# EasyEDA Pro project 包裹款-触摸屏控制板-V1.3(1).epro, schematic Schematic2
Assembly Variant: Basic; Board Name: Board2; Create Date: 2026-06-04; Page Name: P1; Project Name: 包裹款-触摸屏控制板-V1.3; Schematic Name: Schematic2; Update Date: 2026-06-04; Company: 嘉立创EDA; Page Size: A4; Version: V1.0
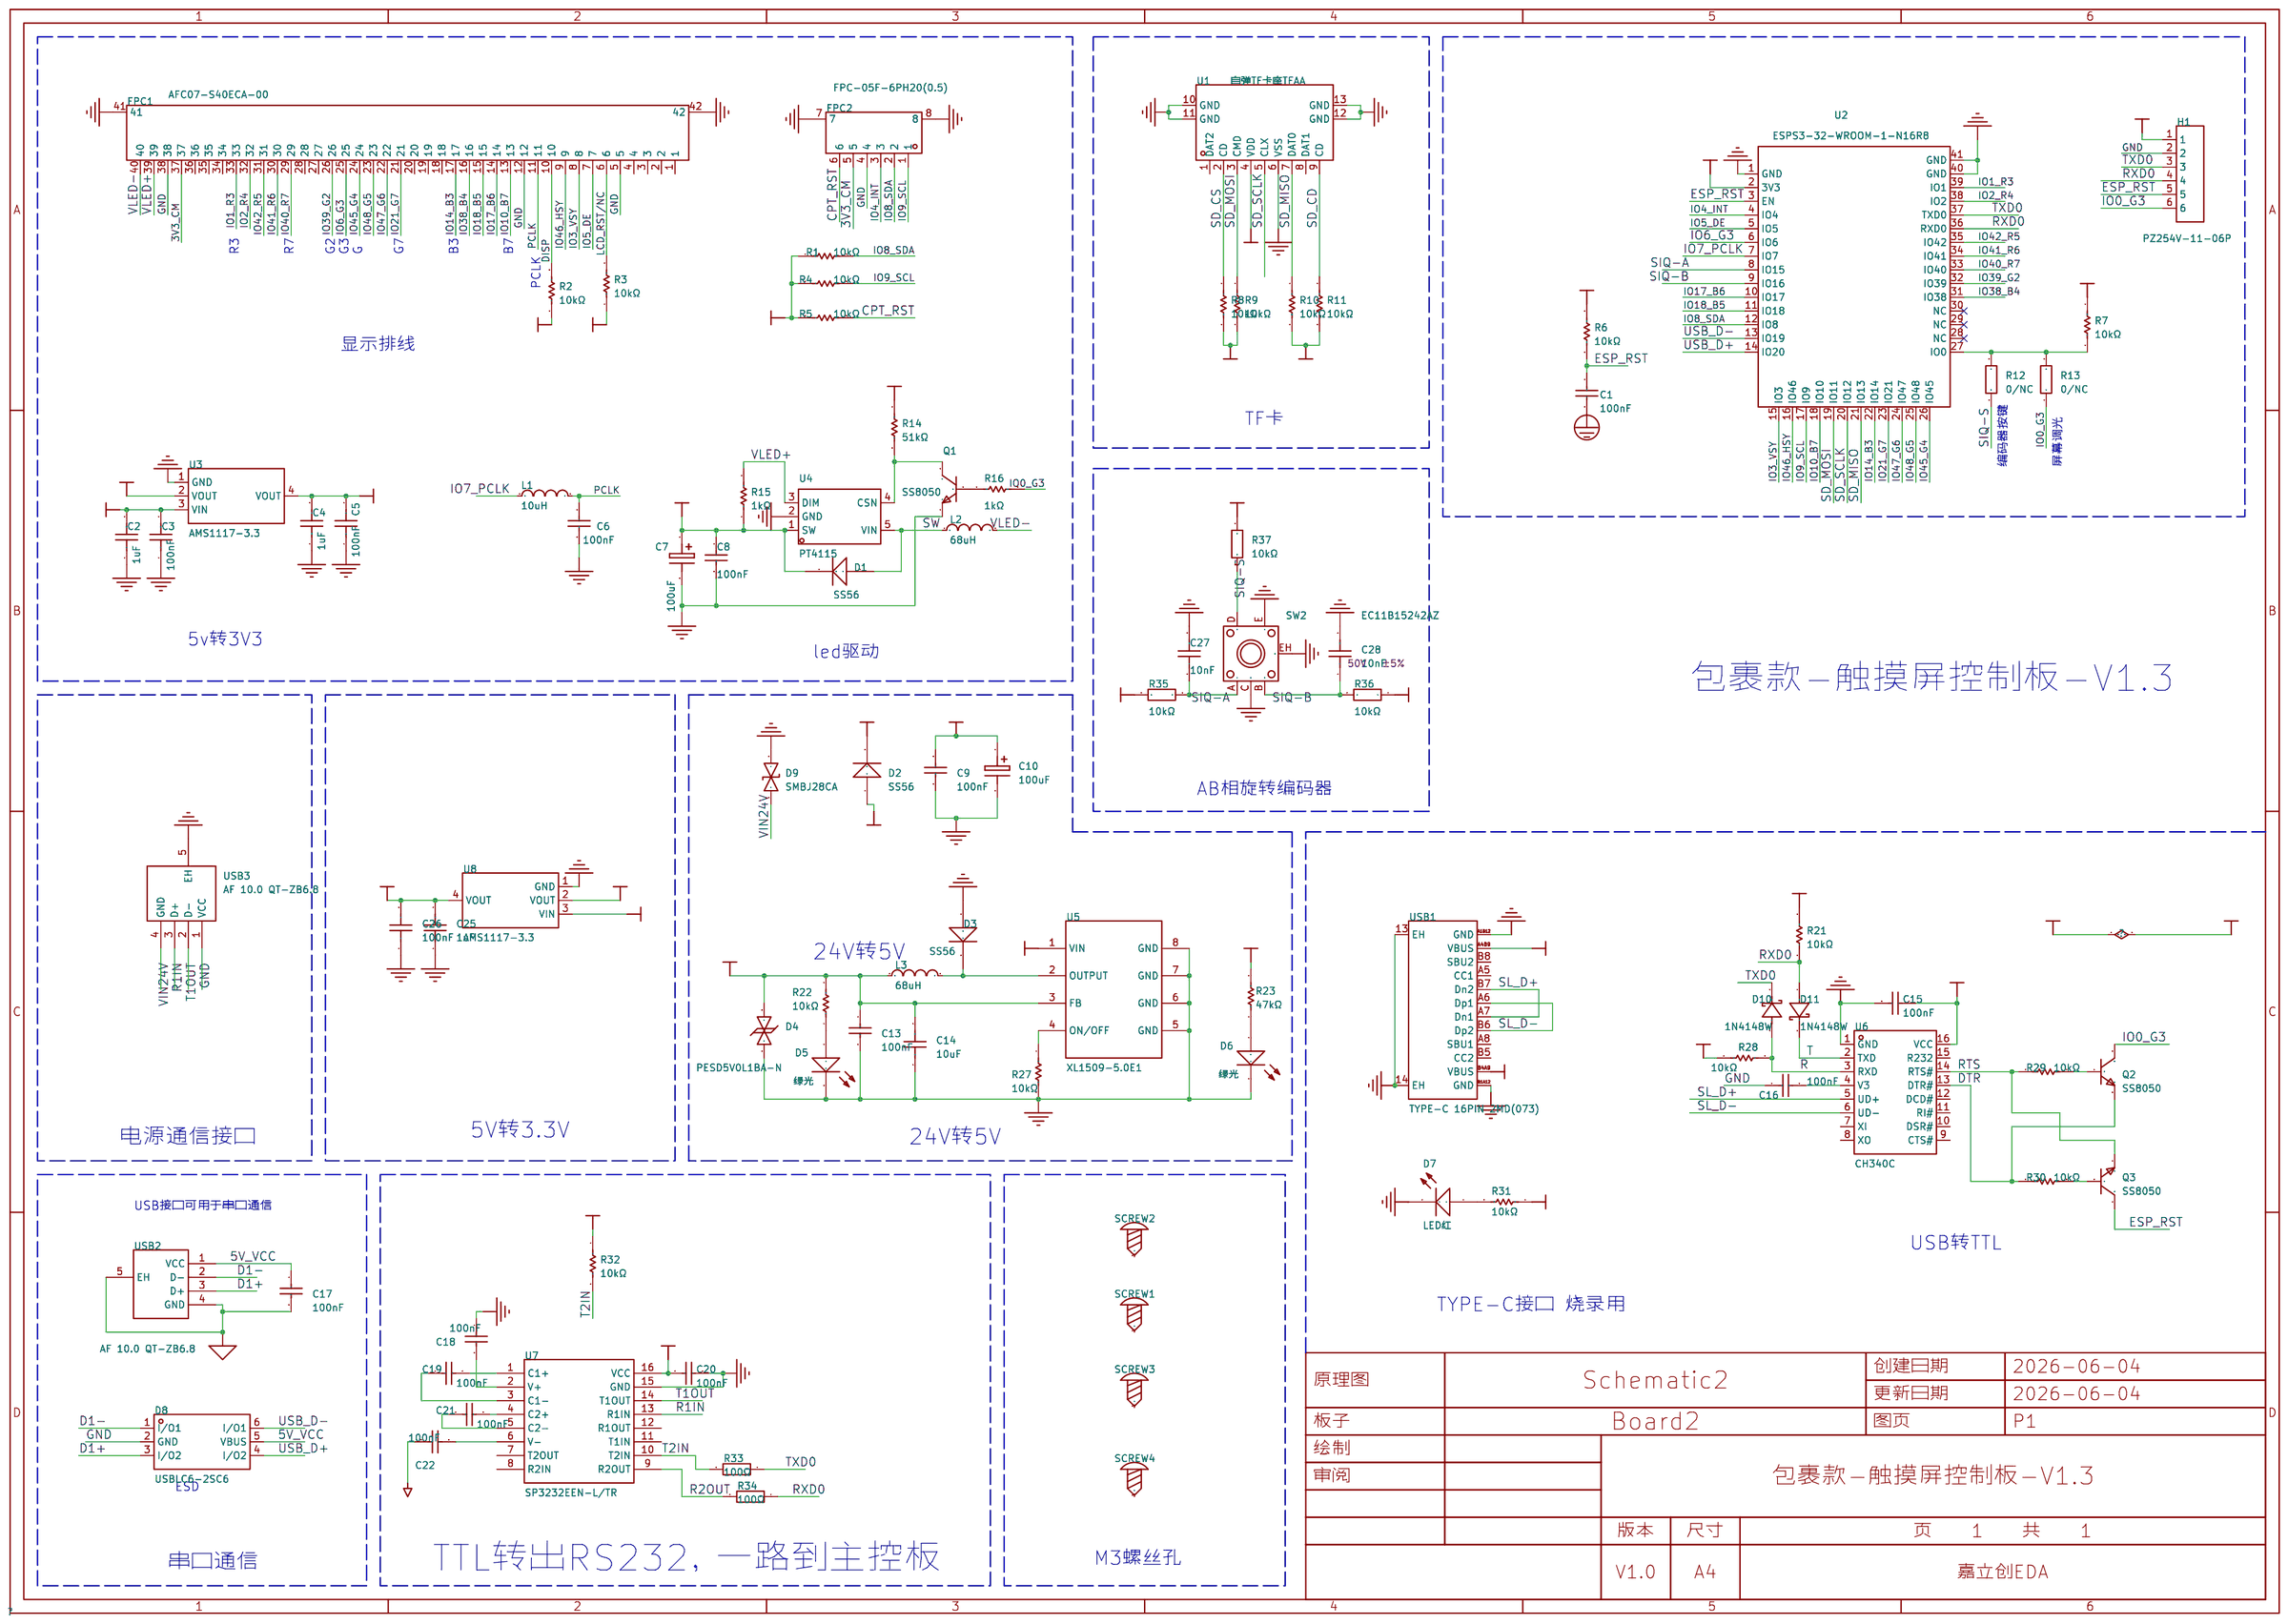
[diagram p0: schematic sheet]

## Parts
C1  100nF  [C0603]
C2  1uF  [C0603]
C3  100nF  [C0603]
C4  1uF  [C0603]
C5  100nF  [C0603]
C6  100nF  [C0603]
C7  100uF  [电解电容贴片6X6]
C8  100nF  [C0603]
C9  100nF  [C0603]
C10  100uF  [电解电容贴片6X6]
C13  100nF  [C0603]
C14  10uF  [C0603]
C15  100nF  [C0603]
C16  100nF  [C0603]
C17  100nF  [C0603]
C18  100nF  [C0603]
C19  100nF  [C0603]
C20  100nF  [C0603]
C21  100nF  [C0603]
C22  100nF  [C0603]
C25  1uF  [C0603]
C26  100nF  [C0603]
C27  10nF  [C0603]
C28  10nF  [C0603]
D1  SS56  [SMA]
D2  SS56  [SMA]
D3  SS56  [SMA]
D4  PESD5V0L1BA-N  [SOD-323_L1.8-W1.3-LS2.5-BI]
D5  绿光  [0603LED]
D6  绿光  [0603LED]
D7  LED红  [0603L]
D8  USBLC6-2SC6  [SOT-23-6_L2.9-W1.6-P0.95-LS2.8-BL]
D9  SMBJ28CA  [SMB_L4.3-W3.6-LS5.4-BI]
D10  1N4148W  [SOD-123_L2.7-W1.6-LS3.7-FD]
D11  1N4148W  [SOD-123_L2.7-W1.6-LS3.7-FD]
FPC1  AFC07-S40ECA-00  [FPC-SMD_P0.50-40P_LCS-SJ-H2.0]
FPC2  FPC-05F-6PH20(0.5)  [FPC-SMD_6P-P0.50_XUNPU_FPC-05F-6PH20]
H1  PZ254V-11-06P  [HDR-TH_6P-P2.54-V-M]
L1  10uH  [L0603]
L2  68uH  [IND-SMD_L7.0-W7.0_SMDRI74-330MT]
L3  68uH  [IND-SMD_L7.0-W7.0_SMDRI74-330MT]
Q1  SS8050  [SOT-23-3_L2.9-W1.3-P1.90-LS2.4-BR]
Q2  SS8050  [SOT-23-3_L2.9-W1.3-P1.90-LS2.4-BR]
Q3  SS8050  [SOT-23-3_L2.9-W1.3-P1.90-LS2.4-BR]
R1  10kΩ  [R0603]
R2  10kΩ  [R0603]
R3  10kΩ  [R0603]
R4  10kΩ  [R0603]
R5  10kΩ  [R0603]
R6  10kΩ  [R0603]
R7  10kΩ  [R0603]
R8  10kΩ  [R0603]
R9  10kΩ  [R0603]
R10  10kΩ  [R0603]
R11  10kΩ  [R0603]
R12  0/NC  [R0603]
R13  0/NC  [R0603]
R14  51kΩ  [R0603]
R15  1kΩ  [R0603]
R16  1kΩ  [R0603]
R21  10kΩ  [R0603]
R22  10kΩ  [R0603]
R23  47kΩ  [R0603]
R27  10kΩ  [R0603]
R28  10kΩ  [R0603]
R29  10kΩ  [R0603]
R30  10kΩ  [R0603]
R31  10kΩ  [R0603]
R32  10kΩ  [R0603]
R33  100Ω  [R0603]
R34  100Ω  [R0603]
R35  10kΩ  [R0603]
R36  10kΩ  [R0603]
R37  10kΩ  [R0603]
SCREW1  -  [M3螺丝]
SCREW2  -  [M3螺丝]
SCREW3  -  [M3螺丝]
SCREW4  -  [M3螺丝]
SW2  EC11B15242AZ  [SW-TH_EC11B1524XX]
U1  自弹TF卡座TFAA  [SIM-SMD_C9900015645]
U2  ESPS3-32-WROOM-1-N16R8  [WIRELM-SMD_ESP32-S3-WROOM-2-N32R8V]
U3  AMS1117-3.3  [SOT-223-3_L6.5-W3.4-P2.30-LS7.0-BR]
U4  PT4115  [SOT-89-5_L4.5-W2.5-P1.50-LS4.5-BR]
U5  XL1509-5.0E1  [SOIC-8_L5.0-W4.0-P1.27-LS6.0-BL]
U6  CH340C  [SOIC-16_L9.9-W3.9-P1.27-LS6.0-BL]
U7  SP3232EEN-L/TR  [SOIC-16_L9.9-W3.9-P1.27-LS6.0-BL]
U8  AMS1117-3.3  [SOT-223-3_L6.5-W3.4-P2.30-LS7.0-BR]
USB1  TYPE-C 16PIN 2MD(073)  [USB-C-SMD_TYPE-C-16PIN-2MD-073]
USB2  AF 10.0 QT-ZB6.8  [USB-A-SMD_AF-10.0-QT-ZB6.8]
USB3  AF 10.0 QT-ZB6.8  [USB-A-SMD_AF-10.0-QT-ZB6.8]

## Library data of the parts
C1 C3 C5 C6 C8 C9 C13 C15-C22 C26 = CL10B104KB8NNNC: 容值:100nF;精度:±10%;额定电压:50V;温度系数:X7R;; LCSC Part Name: 100nF ±10% 50V; Supplier Part: C1591; Manufacturer: SAMSUNG(三星); Supplier Footprint: 0603; JLCPCB Part Class: Extended Part; Datasheet: https://item.szlcsc.com/datasheet/CL10B104KB8NNNC/1943.html; Supplier: LCSC; Tolerance: ±10%; Voltage Rating: 50V; Temperature Coefficient: X7R
C2 C4 C25 = CGA0603X5R105K500JT: 容值:1uF;精度:±10%;额定电压:50V;温度系数:X5R;; LCSC Part Name: 1uF ±10% 50V; Supplier Part: C6119852; Manufacturer: HRE(芯声); Supplier Footprint: 0603; JLCPCB Part Class: Extended Part; Datasheet: https://item.szlcsc.com/datasheet/CGA0603X5R105K500JT/7062558.html; Supplier: LCSC; Tolerance: ±10%; Voltage Rating: 50V; Temperature Coefficient: X5R
C7 C10 = RT35V100M6X5: 容值:100uF;精度:±20%;额定电压:35V;纹波电流:60mA@120Hz;; LCSC Part Name: 100uF ±20% 35V; Supplier Part: C48971024; Manufacturer: JIERR(捷而瑞); Supplier Footprint: SMD,D6.3xL5.4mm; JLCPCB Part Class: Extended Part; Datasheet: https://item.szlcsc.com/datasheet/RT35V100M6X5/51296229.html; Supplier: LCSC; Tolerance: ±20%; Voltage Rating: 35V; Ripple Current: 60mA@120Hz; Diameter: 6.3mm; Height - Seated (Max): 5.4mm; Lifetime: 2000hrs@105℃; Operating Temperature: -40℃~+105℃
C14 = CL10A106MA8NRNC: 容值:10uF;精度:±20%;额定电压:25V;温度系数:X5R;; LCSC Part Name: 10uF ±20% 25V; Supplier Part: C96446; Manufacturer: SAMSUNG(三星); Supplier Footprint: 0603; JLCPCB Part Class: Basic Part; Datasheet: https://item.szlcsc.com/datasheet/CL10A106MA8NRNC/97651.html; Supplier: LCSC; Tolerance: ±20%; Voltage Rating: 25V; Temperature Coefficient: X5R
C27 C28 = GRM1885C1H103JA01D: 容值:10nF;精度:±5%;额定电压:50V;材质(温度系数):C0G;; LCSC Part Name: 10nF ±5% 50V; Supplier Part: C85973; Manufacturer: muRata(村田); Supplier Footprint: 0603; JLCPCB Part Class: Extended Part; Datasheet: https://atta.szlcsc.com/upload/public/pdf/source/20200305/C490387_23319AE8C154DEB24C505E6C82A8106A.pdf; Supplier: LCSC; Tolerance: ±5%; Voltage Rated: 50V; Temperature Coefficient: C0G
D1 D3 = SS56: Design Item ID: 1N4148; Library Name: SCH--װ--
D2 = SS56: Design Item ID: 1N4148; Library Name: SCH封装库
D4 = PESD5V0S1BBN: 极性:Bidirectional;反向关断电压（典型值）:5V (Max);击穿电压（最小值）:6V;箝位电压:15V;峰值脉冲电流（10/1000us）:5A (8/20us);; Supplier Part: C314264; Manufacturer: BORN伯恩半导体; Supplier Footprint: SOD-523; JLCPCB Part Class: Extended Part; Datasheet: https://atta.szlcsc.com/upload/public/pdf/source/20181015/C314264_F9AC5761AC2631DA841FBD1D9C6821E3.pdf; Supplier: LCSC; Polarity: Bidirectional; Voltage - Reverse Standoff (Typ): 5V (Max); Voltage - Breakdown (Min): 6V; Voltage - Clamping (Max) @ Ipp: 15V; Current - Peak Pulse (10/1000μs): 5A (8/20us)
D5 D6 = 绿光: Origin Footprint 2: LED(小); Design Item ID: LED; Library Name: SCH封装库
D7 = LED3: Typical BLUE SiC LED; Published: 8-Jun-2000; LatestRevisionDate: 17-Dec-2003; LatestRevisionNote: PCB Footprint replaced.; DatasheetVersion: 16-Apr-2002; PackageVersion: 16-Apr-2002; PackageReference: 3.5X2.8X1.9; Publisher: Altium Limited; PackageDescription: SM LED; 2 C-Bend Leads; Body 3.5 x 2.8 x 1.9 mm, inc leads (LxWxH typ); Origin Footprint 2: 3.5X2.8X1.9; Library Name: Miscellaneous Devices; Check: true
D8 = USBLC6-2SC6: 最大钳位电压:15V;击穿电压:6V;; Supplier Part: C2687116; Manufacturer: UMW(友台半导体); Supplier Footprint: SOT-23-6; JLCPCB Part Class: 扩展库; Datasheet: https://atta.szlcsc.com/upload/public/pdf/source/20231109/512642D850D9873E7C519F71E85B9A10.pdf; Supplier: LCSC; Maximum Clamping Voltage: 15V; Breakdown Voltage: 6V; Number of Lines: 双路; Type: ESD
D9 = SMBJ28CA_C151259: 反向截止电压(Vrwm):28V;最大钳位电压:45.4V;峰值脉冲电流(Ipp)@10/1000us:13.3A;峰值脉冲功率(Ppp)@10/1000us:600W;击穿电压:31.1V;; Supplier Part: C151259; Manufacturer: Littelfuse(美国力特); Supplier Footprint: SMB(DO-214AA); JLCPCB Part Class: Extended Part; Datasheet: https://atta.szlcsc.com/upload/public/pdf/source/20190807/C409416_D98C874D944FBE9BE31A2BD6B7A21533.pdf; Supplier: LCSC; Reverse Stand-Off Voltage (Vrwm): 28V; Maximum Clamping Voltage: 45.4V; Peak Pulse Current (Ipp)@10/1000us: 13.3A; Peak Pulse Power Dissipation (Ppp)@10/1000us: 600W; Breakdown Voltage: 31.1V; Type: TVS
D10 D11 = 1N4148W_C7420318: 二极管配置:独立式;整流电流:150mA;直流反向耐压(Vr):100V;正向压降(Vf):1.25V@150mA;反向恢复时间(Trr):4ns;; LCSC Part Name: 100V 150mA; Supplier Part: C7420318; Manufacturer: R+O(宏嘉诚); Supplier Footprint: SOD-123; JLCPCB Part Class: Extended Part; Datasheet: https://item.szlcsc.com/datasheet/1N4148W/8397140.html; Supplier: LCSC; Diode Configuration: 独立式; Pd - Power Dissipation: 400mW; Current - Rectified: 150mA; Voltage - DC Reverse(Vr): 100V; Voltage - Forward(Vf@If): 1.25V@150mA; Non-Repetitive Peak Forward Surge Current: 2A; Reverse Leakage Current (Ir): 1uA@75V; Reverse Recovery Time (trr): 4ns; Operating Junction Temperature Range: -55℃~+150℃
FPC1 = AFC07-S40ECA-00: 锁定特性:抽屉式;触点类型:上接;触点数量:40P;间距:0.5mm;安装方式:卧贴;; LCSC Part Name: 间距:0.5mm P数:40P 抽屉式 上接; Supplier Part: C262648; Manufacturer: JS(钜硕电子); Supplier Footprint: SMD,P=0.5mm,卧贴; JLCPCB Part Class: 扩展库; Datasheet: https://item.szlcsc.com/datasheet/AFC07-S40ECA-00/253907.html; Supplier: LCSC; Locking Feature: 抽屉式; Contact Type: 上接; Number of Contacts: 40P; Pitch: 0.5mm; Mounting Type: 卧贴; FFC, FCB Thickness: 0.3mm; Height Above Board: 2mm
FPC2 = FPC-05F-6PH20: 锁定特性:翻盖式;触点类型:卧贴;触点数量:6P;间距:0.5mm;安装方式:下接;工作温度:-25℃~+85℃;; LCSC Part Name: 翻盖式 卧贴 P数:6P 间距:0.5mm; Supplier Part: C2856796; Manufacturer: XUNPU(讯普); Supplier Footprint: SMD,P=0.5mm,卧贴; JLCPCB Part Class: 扩展库; Datasheet: https://item.szlcsc.com/datasheet/FPC-05F-6PH20/3056894.html; Supplier: LCSC; Locking Feature: 翻盖式; Contact Type: 卧贴; Number of Contacts: 6P; Pitch: 0.5mm; Mounting Type: 下接; FFC, FCB Thickness: 0.3mm; Height Above Board: 2mm; Contact Material: 磷青铜; Contact Plating: 锡; Operating Temperature: -25℃~+85℃; Rated Voltage (Max): 50V; Current Rating (Max): 500mA
H1 = PZ254V-11-06P: 插针结构:1x6P;间距:2.54mm;行距:-;圆针/方针:方针;安装方式:直插;排数:单排;总PIN位数:6P;额定电流:-;额定电压:-;配合针长度:6mm;塑高:2.5mm;端接针长度:3mm;触头材质:黄铜;触头镀层:-;工作温度:-40℃~+105℃;颜色:黑色;; LCSC Part Name: 1x6P 间距:2.54mm 方针 直插; Supplier Part: C492405; Manufacturer: XFCN(兴飞); Supplier Footprint: 插件,P=2.54mm; JLCPCB Part Class: 扩展库; Datasheet: https://item.szlcsc.com/datasheet/PZ254V-11-06P/502961.html; Supplier: LCSC; Pin Structure: 1x6P; Pitch: 2.54mm; Circluar Pins/Square Pins: 方针; Mounting Type: 直插; Number of Rows: 单排; Number of Pins: 6P; Length of Mating Pin: 6mm; Insulation Height: 2.5mm; Length of End Connection Pin: 3mm; Contact Material: 黄铜; Operating Temperature: -40℃~+105℃; Color: 黑色
L1 = SDFL1608S100KTF: 电感值:10uH;精度:±10%;额定电流:3mA;饱和电流(Isat):-;直流电阻(DCR):1.85Ω;; LCSC Part Name: 10uH ±10%; Supplier Part: C1035; Manufacturer: Sunlord(顺络); Supplier Footprint: 0603; JLCPCB Part Class: 基础库; Datasheet: https://item.szlcsc.com/datasheet/SDFL1608S100KTF/1387.html; Supplier: LCSC; Tolerance: ±10%; Current Rating: 3mA; DC Resistance(DCR): 1.85Ω; Q @ Frequency: 30@2MHz; Frequency - Self Resonant: 17MHz
L2 L3 = SMMS0650-680M: 电感值:68uH;精度:±20%;额定电流:1.5A;饱和电流(Isat):2A;类型:-;; LCSC Part Name: 68uH ±20% 2A; Supplier Part: C2894721; Manufacturer: SXN(顺翔诺); Supplier Footprint: SMD,6.6x7.1mm; JLCPCB Part Class: Extended Part; Datasheet: https://item.szlcsc.com/datasheet/SMMS0650-680M/3130468.html; Supplier: LCSC; Tolerance: ±20%; Current Rating: 1.5A; Current - Saturation(Isat): 2A; DC Resistance(DCR): 442mΩ
Q1-Q3 = SS8050: LCSC Part Name: NPN 25V 1.5A 120-400 SOT-23; Supplier Part: C2931717; Manufacturer: Doeshare(德芯); Supplier Footprint: SOT-23; JLCPCB Part Class: 扩展库; Datasheet: https://atta.szlcsc.com/upload/public/pdf/source/20220106/99F9A3DFCBDD91265C711555CE6390BF.pdf; Supplier: LCSC
R1-R7 R21 R22 R27 R28 R35-R37 = FRC0603J103 TS: 电阻类型:厚膜电阻;阻值:10kΩ;精度:±5%;功率:100mW;工作电压:75V;温度系数:±100ppm/℃;; LCSC Part Name: 10kΩ ±5% 100mW 厚膜电阻; Supplier Part: C2930027; Manufacturer: FOJAN(富捷); Supplier Footprint: 0603; JLCPCB Part Class: Extended Part; Datasheet: https://item.szlcsc.com/datasheet/FRC0603J103%2520TS/3266960.html; Supplier: LCSC; Type: 厚膜电阻; Tolerance: ±5%; Power(Watts): 100mW; Voltage-Supply(Max): 75V; Temperature Coefficient: ±100ppm/℃; Operating Temperature: -55℃~+155℃
R8-R11 R29-R32 = RT0603BRD0710KL: 电阻类型:薄膜电阻;阻值:10kΩ;精度:±0.1%;功率:100mW;工作电压:75V;温度系数:±25ppm/℃;; LCSC Part Name: 薄膜电阻 10kΩ ±0.1% 100mW; Supplier Part: C95204; Manufacturer: YAGEO(国巨); Supplier Footprint: 0603; JLCPCB Part Class: Extended Part; Datasheet: https://item.szlcsc.com/datasheet/RT0603BRD0710KL/96405.html; Supplier: LCSC; Type: 薄膜电阻; Tolerance: ±0.1%; Power(Watts): 100mW; Voltage-Supply(Max): 75V; Temperature Coefficient: ±25ppm/℃; Operating Temperature: -55℃~+155℃
R12 R13 = Res_0603: Supplier Footprint: 0603
R14 = 0603WAF5102T5E: 电阻类型:厚膜电阻;阻值:51kΩ;精度:±1%;功率:100mW;工作电压:75V;温度系数:±100ppm/℃;; LCSC Part Name: 51kΩ ±1% 100mW 厚膜电阻; Supplier Part: C23196; Manufacturer: UNI-ROYAL(厚声); Supplier Footprint: 0603; JLCPCB Part Class: Basic Part; Datasheet: https://item.szlcsc.com/datasheet/0603WAF5102T5E/23923.html; Supplier: LCSC; Type: 厚膜电阻; Tolerance: ±1%; Power(Watts): 100mW; Voltage-Supply(Max): 75V; Temperature Coefficient: ±100ppm/℃; Operating Temperature: -55℃~+155℃
R15 R16 = FRC0603F1001TS: 电阻类型:厚膜电阻;阻值:1kΩ;精度:±1%;功率:100mW;工作电压:75V;温度系数:±100ppm/℃;; LCSC Part Name: 1kΩ ±1% 100mW 厚膜电阻; Supplier Part: C2907002; Manufacturer: FOJAN(富捷); Supplier Footprint: 0603; JLCPCB Part Class: Extended Part; Supplier: LCSC; Type: 厚膜电阻; Tolerance: ±1%; Power(Watts): 100mW; Voltage-Supply(Max): 75V; Temperature Coefficient: ±100ppm/℃; Operating Temperature: -55℃~+155℃
R23 = FRC0603F4702TS: 电阻类型:厚膜电阻;阻值:47kΩ;精度:±1%;功率:100mW;工作电压:75V;温度系数:±100ppm/℃;; LCSC Part Name: 47kΩ ±1% 100mW 厚膜电阻; Supplier Part: C2907042; Manufacturer: FOJAN(富捷); Supplier Footprint: 0603; JLCPCB Part Class: Extended Part; Supplier: LCSC; Type: 厚膜电阻; Tolerance: ±1%; Power(Watts): 100mW; Voltage-Supply(Max): 75V; Temperature Coefficient: ±100ppm/℃; Operating Temperature: -55℃~+155℃
R33 R34 = 0603WAF1000T5E: 电阻类型:厚膜电阻;阻值:100Ω;精度:±1%;功率:100mW;最大工作电压:75V;温度系数:±200ppm/℃;; LCSC Part Name: 100Ω ±1% 100mW 厚膜电阻; Supplier Part: C22775; Manufacturer: UNI-ROYAL(厚声); Supplier Footprint: 0603; JLCPCB Part Class: Basic Part; Datasheet: https://atta.szlcsc.com/upload/public/pdf/source/20200306/C422600_1E6D84923E4A46A82E41ADD87F860B5C.pdf; Supplier: LCSC; Type: 厚膜电阻; Tolerance: ±1%; Power(Watts): 100mW; Overload Voltage (Max): 75V; Temperature Coefficient: ±200ppm/℃; Operating Temperature Range: -55℃~+155℃
SCREW1-SCREW4 = M3螺丝: Supplier Footprint: 插件
SW2 = EC11B15242AZ: LCSC Part Name: EC11B15242AZ 三件套 停产; Supplier Part: C470746; Manufacturer: ALPSALPINE(阿尔卑斯阿尔派); Supplier Footprint: 插件; JLCPCB Part Class: Extended Part; Datasheet: https://item.szlcsc.com/datasheet/EC11B15242AZ/476826.html; Supplier: LCSC
U1 = 自弹TF卡座TFAA: Supplier Part: C9900015645; Supplier Footprint: SMD; JLCPCB Part Class: 扩展库; Supplier: LCSC
U2 = ESP32-S3-WROOM-2-N32R8V: 核心处理器:ESP32-S3R8V芯片;频率:2.4GHz;发射功率:20.5dBm;; Supplier Part: C3021270; Manufacturer: ESPRESSIF(乐鑫); Supplier Footprint: SMD-41P; JLCPCB Part Class: 扩展库; Datasheet: https://atta.szlcsc.com/upload/public/pdf/source/20240130/C1D348304CAAF72A05B43D2BF874139A.pdf; Supplier: LCSC; Core Processor: ESP32-S3R8V芯片; Support Interface: I2C；GPIO；SPI；PWM；ADC；UART；USB；I2S; Output Power: 20.5dBm
U3 U8 = AMS1117-3.3_C6186: 输出类型:固定;工作电压:15V;输出电压:3.3V;输出电流:1A;电源纹波抑制比(PSRR):72dB@(120Hz);输出极性:正极;; LCSC Part Name: 3.3V 1A 15V; Supplier Part: C6186; Manufacturer: AMS; Supplier Footprint: SOT-223; JLCPCB Part Class: Basic Part; Datasheet: https://item.szlcsc.com/datasheet/AMS1117-3.3/6652.html; Supplier: LCSC; Output Type: 固定; Voltage - Supply: 15V; Output Voltage: 3.3V; Output Current: 1A; Power Supply Rejection Ratio (PSRR): 72dB@(120Hz); Voltage Dropout: 1.1V@(800mA); standby current: 5mA; Noise: 0.003%Vout; Features: 过流保护；热关断; Operating Temperature: -40℃~+125℃; Output Configuration: 正极; Number of Outputs: 1
U4 = PT4115_C347356: 类型:DC-DC;工作电压(DC):6V~30V;开关频率:1MHz;通道数:-;输出电压:-;输出电流:1.2A;调光:PWM；模拟;拓扑结构:降压;; LCSC Part Name: 30 V/1.2 A高调光比LED恒流驱动器; Supplier Part: C347356; Manufacturer: UMW(友台半导体); Supplier Footprint: SOT-89-5; JLCPCB Part Class: 扩展库; Datasheet: https://item.szlcsc.com/datasheet/PT4115/324016.html; Supplier: LCSC; Type: DC-DC; Voltage - Input(DC): 6V~30V; Frequency - Switching: 1MHz; Output Current: 1.2A; Dimming: PWM；模拟; Features: 过温保护(OTP); Topology: 降压; Operating temperature: -25℃~+85℃; Switch Tube (Built-In/External): 内置; Constant Current Accuracy: 5%
U5 = XL1509-5.0E1: 功能类型:降压型;工作电压:4.5V~40V;输出电压:5V;输出电流:2A;输出类型:固定;; LCSC Part Name: 2A 150KHz 40V 降压 DC-DC 转换器; Supplier Part: C61063; Manufacturer: XLSEMI(芯龙); Supplier Footprint: SOIC-8; JLCPCB Part Class: Basic Part; Datasheet: https://item.szlcsc.com/datasheet/XL1509-5.0E1/62115.html; Supplier: LCSC; Function: 降压型; Voltage - Supply: 4.5V~40V; Output Voltage: 5V; Output Current: 2A; Frequency - Switching: 150kHz; Operating Temperature: -40℃~+85℃; Synchronous Rectifier: 否; Number of Outputs: 1; Topology: 降压式; Quiescent Current: 2mA; Switch tube (built-in/external): 内置; Output Type: 固定
U6 = CH340G: 应用功能:收发器;接口协议:USB 2.0;数据速率:2Mbps;; LCSC Part Name: USB转串口芯片 CH340; Supplier Part: C14267; Manufacturer: WCH(南京沁恒); Supplier Footprint: SOP-16; JLCPCB Part Class: 扩展库; Datasheet: https://atta.szlcsc.com/upload/public/pdf/source/20230530/6E401E9554E9F5311886CC8B3F89B62E.pdf; Supplier: LCSC; Applications Function: 收发器; Protocol: USB 2.0; Supply Voltage: 3.3V；5V; Data Rate: 2Mbps
U7 = SP3232EEN-L/TR: 类型:收发器;数据速率:235Kbps;; LCSC Part Name: True3.0V至5.5V RS-232收发器; Supplier Part: C9378; Manufacturer: MaxLinear(迈凌); Supplier Footprint: SOIC-16; JLCPCB Part Class: 扩展库; Datasheet: https://item.szlcsc.com/datasheet/SP3232EEN-L%252FTR/9907.html; Supplier: LCSC; Type: 收发器; Number of Drivers: 2; Number of Receivers: 2; Data Rate: 235Kbps; Voltage - Supply: 3V~5.5V; Operating Temperature: -40℃~+85℃
USB1 = TYPE-C 16PIN 2MD(073): 连接器类型:Type-C;协议标准:-;公母:母;安装方式:卧贴;触点数量:16P;端口数量:1;额定电流 - 电源:3A;工作温度:-25℃~+85℃;; LCSC Part Name: Type-C 母 卧贴; Supplier Part: C2765186; Manufacturer: SHOU HAN(首韩); Supplier Footprint: SMD; JLCPCB Part Class: Extended Part; Datasheet: https://item.szlcsc.com/datasheet/TYPE-C%252016PIN%25202MD(073)/2901843.html; Supplier: LCSC; Connector Type: Type-C; Gender: 母; Mounting Type: 卧贴; Number of Contacts: 16P; Number of Ports: 1; Current Rating-Power: 3A; Voltage Rating: 5V; Connect-Disconnect Life: 1万次; Detection color: 黑色; Operating Temperature: -25℃~+85℃
USB2 USB3 = AF 10.0 QT-ZB6.8: 连接器类型:Type-A;协议标准:USB 2.0;公母:母;安装方式:卧贴;触点数量:4P;端口数量:1;额定电流 - 电源:1.5A;工作温度:-25℃~+85℃;; LCSC Part Name: Type-A 母 卧贴; Supplier Part: C456016; Manufacturer: SHOU HAN(首韩); Supplier Footprint: SMD; Datasheet: https://item.szlcsc.com/datasheet/AF%252010.0%2520QT-ZB6.8/458823.html; Supplier: LCSC; Connector Type: Type-A; Protocol Standard: USB 2.0; Gender: 母; Mounting Type: 卧贴; Number of Contacts: 4P; Number of Ports: 1; Current Rating-Power: 1.5A; Voltage Rating: 30V; Connect-Disconnect Life: 5千次; Length: 10mm; Detection color: 黑色; Operating Temperature: -25℃~+85℃

## Nets
3V3: C25.2 C26.2 R6.1 R7.1 R8.2 R9.2 R10.2 R11.2 R21.2 U1.4(VDD) U2.2(3V3) U8.2(VOUT) U8.4(VOUT)
3V3_CM: C4.2 C5.2 FPC1.37 FPC2.5 R1.1 R2.1 R3.1 R4.1 R5.1 U3.2(VOUT) U3.4(VOUT)
5V_SHAOLU: C2.2 C3.2 C13.1 C14.2 C15.1 C17.1 C20.2 D4.2 D8.5(VBUS) H1.1 L3.1 R22.2 R28.1 R31.1 R32.1 R35.1 R36.1 R37.1 U3.3(VIN) U5.3(FB) U6.16(VCC) U7.16(VCC) U8.3(VIN) USB1.A4B9(VBUS) USB1.B4A9(VBUS) USB2.1(VCC)
24V_D1: C7.1 C8.1 C9.2 C10.1 D1.2 D2.2 R14.1 R15.1 R23.2 U4.1(SW) U5.1(VIN)
GND: C1.1 C2.1 C3.1 C4.1 C5.1 C6.1 C7.2 C8.2 C9.1 C10.2 C13.2 C14.1 C15.2 C16.2 C17.2 C18.1 C20.1 C22.2 C25.1 C26.1 C27.2 C28.2 D3.1 D4.1 D5.2 D6.2 D7.2(K) D8.2(GND) D9.2(A) FPC1.5 FPC1.12 FPC1.38 FPC1.41 FPC1.42 FPC2.4 FPC2.7 FPC2.8 H1.2 Q1.2(E) R27.2 SW2.C SW2.E SW2.EH U1.6(VSS) U1.10(GND) U1.11(GND) U1.12(GND) U1.13(GND) U2.1(GND) U2.40(GND) U2.41(GND) U3.1(GND) U4.2(GND) U5.5(GND) U5.6(GND) U5.7(GND) U5.8(GND) U6.1(GND) U7.15(GND) U8.1(GND) USB1.13(EH) USB1.14(EH) USB1.A1B12(GND) USB1.B1A12(GND) USB2.4(GND) USB2.5(EH) USB3.1(VCC) USB3.5(EH)
VIN24V: D2.1 D9.1(K) USB3.4(GND)
CPT_RST: FPC2.6 R5.2
D1+: D8.3(I/O2) USB2.3(D+)
D1-: D8.1(I/O1) USB2.2(D-)
DISP: FPC1.10 R2.2
DTR: Q2.2(E) R30.2 U6.13(DTR#)
ESP_RST: C1.2 H1.5 Q3.3(C) R6.2 U2.3(EN)
IO0_G3: H1.6 Q2.3(C) R13.1 R16.2
IO1_R3: FPC1.33 U2.39(IO1)
IO2_R4: FPC1.32 U2.38(IO2)
IO3_VSY: FPC1.8 U2.15(IO3)
IO4_INT: FPC2.3 U2.4(IO4)
IO5_DE: FPC1.7 U2.5(IO5)
IO6_G3: FPC1.25 U2.6(IO6)
IO7_PCLK: L1.2 U2.7(IO7)
IO8_SDA: FPC2.2 R1.2 U2.12(IO8)
IO9_SCL: FPC2.1 R4.2 U2.17(IO9)
IO10_B7: FPC1.13 U2.18(IO10)
IO14_B3: FPC1.17 U2.22(IO14)
IO17_B6: FPC1.14 U2.10(IO17)
IO18_B5: FPC1.15 U2.11(IO18)
IO21_G7: FPC1.21 U2.23(IO21)
IO38_B4: FPC1.16 U2.31(IO38)
IO39_G2: FPC1.26 U2.32(IO39)
IO40_R7: FPC1.29 U2.33(IO40)
IO41_R6: FPC1.30 U2.34(IO41)
IO42_R5: FPC1.31 U2.35(IO42)
IO45_G4: FPC1.24 U2.26(IO45)
IO46_HSY: FPC1.9 U2.16(IO46)
IO47_G6: FPC1.22 U2.24(IO47)
IO48_G5: FPC1.23 U2.25(IO48)
LCD_RST/NC: FPC1.6 R3.2
PCLK: C6.2 FPC1.11 L1.1
R: D10.1(A) R28.2 U6.3(RXD)
R1IN: U7.13(R1IN) USB3.3(D+)
R2OUT: R34.2 U7.9(R2OUT)
RTS: Q3.2(E) R29.2 U6.14(RTS#)
RXD0: D11.1(A) H1.4 R21.1 R34.1 U2.36(RXD0)
SD_CD: R11.1 U1.9(CD)
SD_CS: R8.1 U1.2(CD)
SD_MISO: R10.1 U1.7(DAT0) U2.21(IO13)
SD_MOSI: R9.1 U1.3(CMD) U2.19(IO11)
SD_SCLK: U1.5(CLX) U2.20(IO12)
SIQ-A: C27.1 R35.2 SW2.A U2.8(IO15)
SIQ-B: C28.1 R36.2 SW2.B U2.9(IO16)
SIQ-S: R12.1 R37.2 SW2.D
SL_D+: U6.5(UD+) USB1.A7(Dn1) USB1.B7(Dn2)
SL_D-: U6.6(UD-) USB1.A6(Dp1) USB1.B6(Dp2)
SW: D1.1 L2.1 U4.5(VIN)
T: D11.2(K) U6.2(TXD)
T1OUT: U7.14(T1OUT) USB3.2(D-)
T2IN: R32.2 R33.2 U7.10(T2IN)
TXD0: D10.2(K) H1.3 R33.1 U2.37(TXD0)
USB_D+: D8.4(I/O2) U2.14(IO20)
USB_D-: D8.6(I/O1) U2.13(IO19)
VLED+: FPC1.39 R15.2 U4.3(DIM)
VLED-: FPC1.40 L2.2
$1N113: R7.2 R12.2 R13.2 U2.27(IO0)
$1N129: D3.2 L3.2 U5.2(OUTPUT)
$1N130: R27.1 U5.4(ON/OFF)
$1N134: D6.1 R23.1
$1N136: D5.1 R22.1
$1N138: C16.1 U6.4(V3)
$1N150: Q2.1(B) R29.1
$1N151: Q3.1(B) R30.1
$1N159: D7.1(A) R31.2
$1N165: C22.1 U7.6(V-)
$1N168: C18.2 U7.2(V+)
$1N169: C21.2 U7.4(C2+)
$1N170: C21.1 U7.5(C2-)
$1N171: C19.2 U7.1(C1+)
$1N172: C19.1 U7.3(C1-)
$1N204: Q1.3(C) R14.2 U4.4(CSN)
$1N207: Q1.1(B) R16.1

Not connected (* = marked no-connect by the designer): FPC1 1 2 3 4 18 19 20 27 28 34 35 36; SCREW1 1; SCREW2 1; SCREW3 1; SCREW4 1; U1 1(DAT2) 8(DAT1); U2 28(NC)* 29(NC)* 30(NC)*; U6 7(XI) 8(XO) 9(CTS#) 10(DSR#) 11(RI#) 12(DCD#) 15(R232); U7 7(T2OUT) 8(R2IN) 11(T1IN) 12(R1OUT); USB1 A5(CC1) A8(SBU1) B5(CC2) B8(SBU2)

## Notes on the sheet
- R3
- R7
- G2
- G3
- G
- G7
- B3
- B7
- PCLK
- 显示排线
- TF卡
- 编码器按键
- 屏幕调光
- 5v转3V3
- led驱动
- 包裹款-触摸屏控制板-V1.3
- AB相旋转编码器
- 24V转5V
- 电源通信接口
- 5V转3.3V
- 24V转5V
- USB接口可用于串口通信
- USB转TTL
- TYPE-C接口 烧录用
- ESD
- TTL转出RS232，一路到主控板
- M3螺丝孔
- 串口通信
